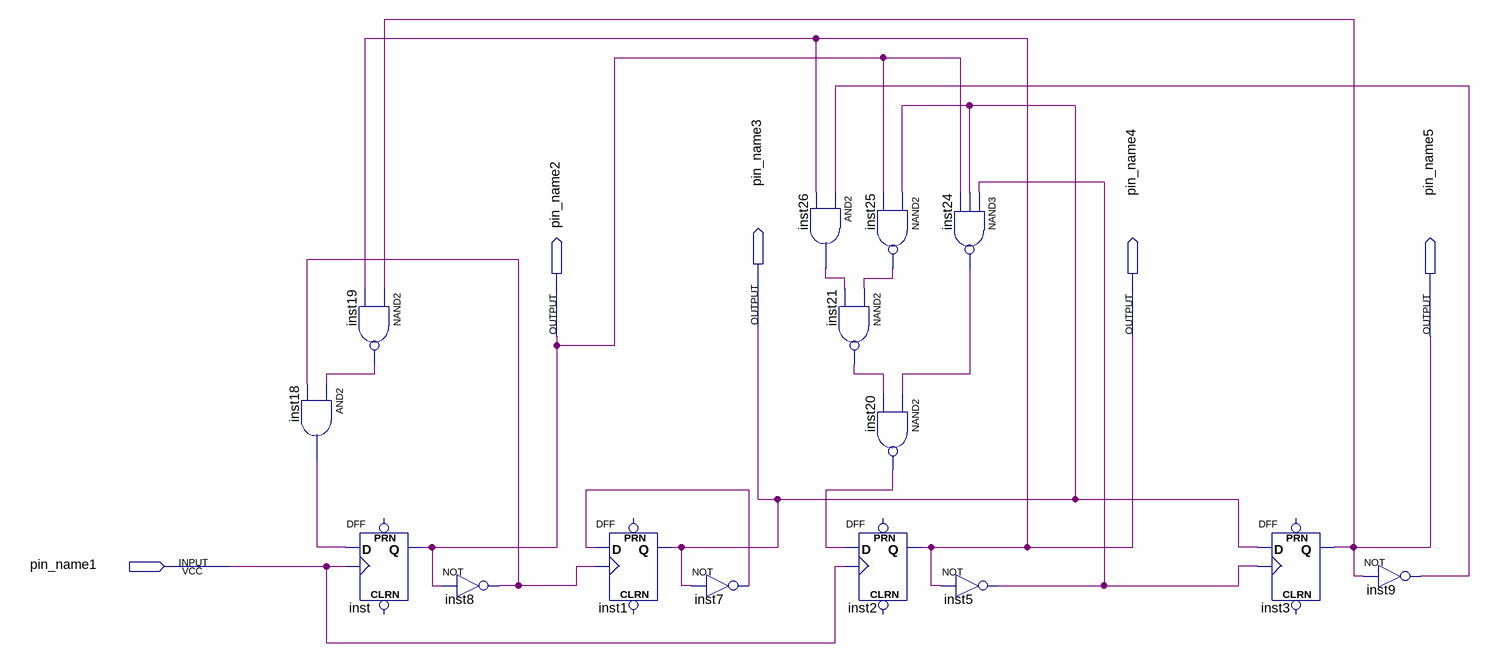
[diagram p0: schematic sheet]
// Quartus schematic asyncmod13.bdf as structural Verilog: 15 symbols, 5 pins
module asyncmod13 (
  input  pin_name1,
  output pin_name3,
  output pin_name2,
  output pin_name4,
  output pin_name5
);

  wire inst5_out, inst7_out, inst8_out, inst9_out, inst18_out, inst19_out, inst20_out, inst21_out,
       inst24_out, inst25_out, inst26_out;

  nand inst19 (inst19_out, pin_name5, pin_name4);
  and inst18 (inst18_out, inst19_out, inst8_out);
  DFF inst (.CLK(pin_name1), .D(inst18_out), .Q(pin_name2));  // open: CLRN, PRN
  not inst8 (inst8_out, pin_name2);
  DFF inst1 (.CLK(inst8_out), .D(inst7_out), .Q(pin_name3));  // open: CLRN, PRN
  not inst7 (inst7_out, pin_name3);
  and inst26 (inst26_out, inst9_out, pin_name4);
  nand inst25 (inst25_out, pin_name3, pin_name2);
  nand inst21 (inst21_out, inst25_out, inst26_out);
  nand inst20 (inst20_out, inst24_out, inst21_out);
  DFF inst2 (.CLK(pin_name1), .D(inst20_out), .Q(pin_name4));  // open: CLRN, PRN
  nand inst24 (inst24_out, inst5_out, pin_name3, pin_name2);
  not inst5 (inst5_out, pin_name4);
  DFF inst3 (.CLK(inst5_out), .D(pin_name3), .Q(pin_name5));  // open: CLRN, PRN
  not inst9 (inst9_out, pin_name5);
endmodule
